# EAGLE design SNARFBASE-v03i4 (EAGLE 5.11)
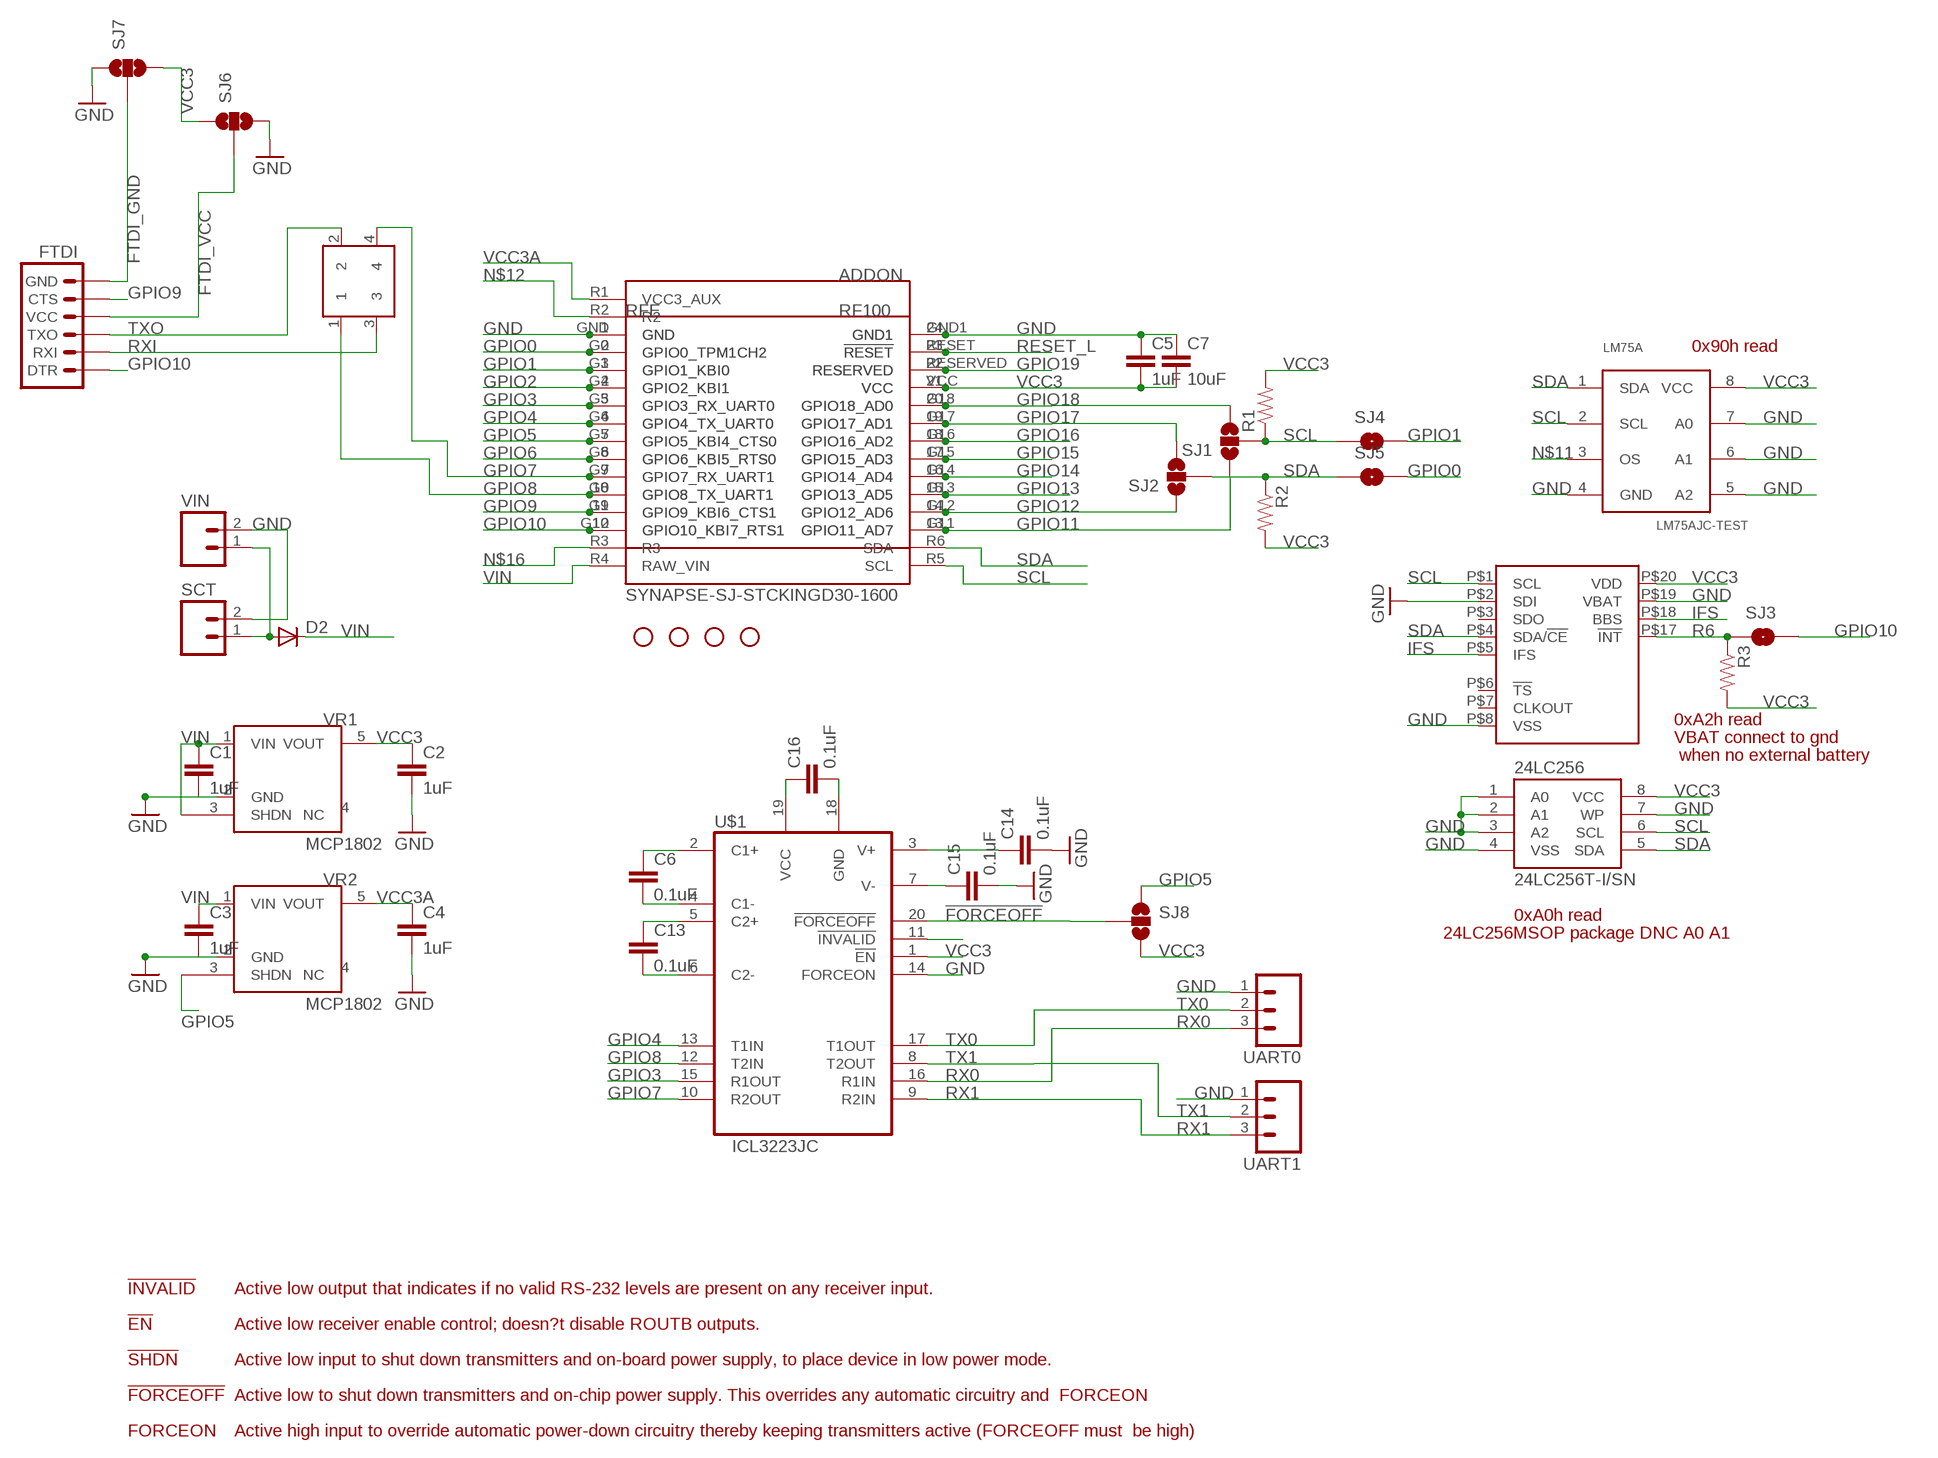
[diagram p0: schematic, sheet 1]

## Parts
24LC256  24LC256T-I/SN  EEPROM-I2CSMD  [SO08]
ADDON  SYNAPSE-SJ-STCKINGD30-1600  [SYNSJ-STACK]
C1  1uF  CAP0805  [0805]
C2  1uF  CAP0805  [0805]
C3  1uF  CAP0805  [0805]
C4  1uF  CAP0805  [0805]
C5  1uF  CAP0805  [0805]
C6  0.1uF  CAP0805  [0805]
C7  10uF  CAP0805  [0805]
C13  0.1uF  CAP0805  [0805]
C14  0.1uF  CAP0805  [0805]
C15  0.1uF  CAP0805  [0805]
C16  0.1uF  CAP0805  [0805]
D2  DIODESMA  [SMA-DIODE]
FTDI  ARDUINO_SERIAL_PROGRAMPTH  [1X06]
JP6  STAND-OFF  [STAND-OFF]
JP9  STAND-OFF  [STAND-OFF]
JP10  STAND-OFF  [STAND-OFF]
JP11  STAND-OFF  [STAND-OFF]
LM75A  LM75AJC-TEST  [TSSOP8-3MM]
PCF2129A  PCF2129ASO20  [SO20W]
R1  RESISTOR  [0805]
R2  RESISTOR  [0805]
R3  RESISTOR  [0805]
RFE  RFE  RF100-JACKJACK2  [SYNAPSERFENGINE-THM-SMT-JACK2]
RXTX  SERIAL_CROSSOVER  [2X02_PTH]
SCT  M023.5MM  [SCREWTERMINAL-3.5MM-2]
SJ1  SOLDERJUMPER_2WAYS  [SJ_3]
SJ2  SOLDERJUMPER_2WAYS  [SJ_3]
SJ3  SOLDERJUMPERNC2  [SJ_2S-NOTRACE]
SJ4  SOLDERJUMPERNO  [SJ_2S-NO]
SJ5  SOLDERJUMPERNO  [SJ_2S-NO]
SJ6  SOLDERJUMPER_2WAYPASTE1&2  [SJ_3_PASTE1&2]
SJ7  SOLDERJUMPER_2WAYPASTE1&2  [SJ_3_PASTE1&2]
SJ8  SOLDERJUMPER_2WAYPASTE1&2  [SJ_3_PASTE1&2]
U$1  ICL3223JC  [TSSOP20-JC]
UART0  M03PTH  [1X03]
UART1  M03PTH  [1X03]
VIN  M02PTH  [1X02]
VR1  MCP1802  [SOT23-5]
VR2  MCP1802  [SOT23-5]

## Nets
!FORCEOFF: SJ8.2 U$1.20(!FORCEOFF)
!INVALID: U$1.11(!INVALID)
FTDI_GND: FTDI.6(GND) SJ7.2
FTDI_VCC: FTDI.4(VCC) SJ6.2
GND: 24LC256.1(A0) 24LC256.2(A1) 24LC256.3(A2) 24LC256.4(VSS) 24LC256.7(WP) ADDON.GND ADDON.GND1 C1.2 C2.2 C3.2 C4.2 C5.1 C7.1 C14.2 C15.2 C16.2 LM75A.4(GND) LM75A.5(A2) LM75A.6(A1) LM75A.7(A0) PCF2129A.P$2(SDI) PCF2129A.P$8(VSS) PCF2129A.P$19(VBAT) RFE.1(GND) RFE.24(GND1) RFE.P1 RFE.P24 RFE.P201 RFE.P224 SCT.2 SJ6.3 SJ7.1 U$1.14(FORCEON) U$1.18(GND) UART0.1 UART1.1 VIN.2 VR1.2(GND) VR2.2(GND)
GPIO0: ADDON.G0(GPIO0_TPM1CH2) RFE.2(GPIO0_TPM1CH2) RFE.P2 RFE.P202 SJ5.2
GPIO1: ADDON.G1(GPIO1_KBI0) RFE.3(GPIO1_KBI0) RFE.P3 RFE.P203 SJ4.2
GPIO2: ADDON.G2(GPIO2_KBI1) RFE.4(GPIO2_KBI1) RFE.P4 RFE.P204
GPIO3: ADDON.G3(GPIO3_RX_UART0) RFE.5(GPIO3_RX_UART0) RFE.P5 RFE.P205 U$1.15(R1OUT)
GPIO4: ADDON.G4(GPIO4_TX_UART0) RFE.6(GPIO4_TX_UART0) RFE.P6 RFE.P206 U$1.13(T1IN)
GPIO5: ADDON.G5(GPIO5_KBI4_CTS0) RFE.7(GPIO5_KBI4_CTS0) RFE.P7 RFE.P207 SJ8.1 VR2.3(SHDN)
GPIO6: ADDON.G6(GPIO6_KBI5_RTS0) RFE.8(GPIO6_KBI5_RTS0) RFE.P8 RFE.P208
GPIO7: ADDON.G7(GPIO7_RX_UART1) RFE.9(GPIO7_RX_UART1) RFE.P9 RFE.P209 RXTX.4 U$1.10(R2OUT)
GPIO8: ADDON.G8(GPIO8_TX_UART1) RFE.10(GPIO8_TX_UART1) RFE.P10 RFE.P210 RXTX.1 U$1.12(T2IN)
GPIO9: ADDON.G9(GPIO9_KBI6_CTS1) FTDI.5(CTS) RFE.11(GPIO9_KBI6_CTS1) RFE.P11 RFE.P211
GPIO10: ADDON.G10(GPIO10_KBI7_RTS1) FTDI.1(DTR) RFE.12(GPIO10_KBI7_RTS1) RFE.P12 RFE.P212 SJ3.2
GPIO11: ADDON.G11(GPIO11_AD7) RFE.13(GPIO11_AD7) RFE.P13 RFE.P213 SJ1.1
GPIO12: ADDON.G12(GPIO12_AD6) RFE.14(GPIO12_AD6) RFE.P14 RFE.P214 SJ2.1
GPIO13: ADDON.G13(GPIO13_AD5) RFE.15(GPIO13_AD5) RFE.P15 RFE.P215
GPIO14: ADDON.G14(GPIO14_AD4) RFE.16(GPIO14_AD4) RFE.P16 RFE.P216
GPIO15: ADDON.G15(GPIO15_AD3) RFE.17(GPIO15_AD3) RFE.P17 RFE.P217
GPIO16: ADDON.G16(GPIO16_AD2) RFE.18(GPIO16_AD2) RFE.P18 RFE.P218
GPIO17: ADDON.G17(GPIO17_AD1) RFE.19(GPIO17_AD1) RFE.P19 RFE.P219 SJ2.3
GPIO18: ADDON.G18(GPIO18_AD0) RFE.20(GPIO18_AD0) RFE.P20 RFE.P220 SJ1.3
GPIO19: ADDON.RESERVED RFE.22(RESERVED) RFE.P22 RFE.P222
IFS: PCF2129A.P$5(IFS) PCF2129A.P$18(BBS)
N$1: C13.1 U$1.5(C2+)
N$2: C13.2 U$1.6(C2-)
N$3: C6.1 U$1.2(C1+)
N$5: C6.2 U$1.4(C1-)
N$9: C14.1 U$1.3(V+)
N$10: C15.1 U$1.7(V-)
N$11: LM75A.3(OS)
N$12: ADDON.R2
N$16: ADDON.R3
R6: PCF2129A.P$17(!INT) R3.1 SJ3.1
RESET_L: ADDON.RESET(!RESET) RFE.23(!RESET) RFE.P23 RFE.P223
RX0: UART0.3
RX1: U$1.9(R2IN) UART1.3
RXI: FTDI.2(RXI) RXTX.3
SCL: 24LC256.6(SCL) ADDON.R5(SCL) LM75A.2(SCL) PCF2129A.P$1(SCL) R1.1 SJ1.2 SJ4.1
SDA: 24LC256.5(SDA) ADDON.R6(SDA) LM75A.1(SDA) PCF2129A.P$4(SDA/!CE) R2.1 SJ2.2 SJ5.1
TX0: U$1.17(T1OUT) UART0.2
TX1: UART1.2
TXO: FTDI.3(TXO) RXTX.2
VCC3: 24LC256.8(VCC) ADDON.VCC C2.1 C5.2 C7.2 C16.1 LM75A.8(VCC) PCF2129A.P$20(VDD) R1.2 R2.2 R3.2 RFE.21(VCC) RFE.P21 RFE.P221 SJ6.1 SJ7.3 SJ8.3 U$1.1(!EN) U$1.19(VCC) VR1.5(VOUT)
VCC3A: ADDON.R1(VCC3_AUX) C4.1 VR2.5(VOUT)
VIN: ADDON.R4(RAW_VIN) C1.1 C3.1 D2.C VR1.1(VIN) VR1.3(SHDN) VR2.1(VIN)
VIN_PREDIODE: D2.A SCT.1 VIN.1
Unconnected: PCF2129A.P$3(SDO) PCF2129A.P$6(!TS) PCF2129A.P$7(CLKOUT) U$1.8(T2OUT) U$1.16(R1IN) VR1.4(NC) VR2.4(NC)

## Notes on the sheet
- 0x90h read
- 0xA2h read
- VBAT connect to gnd
- when no external battery
- 0xA0h read
- 24LC256MSOP package DNC A0 A1
- !INVALID | Active low output that indicates if no valid RS-232 levels are present on any receiver input.
- !EN | Active low receiver enable control; doesn?t disable ROUTB outputs.
- !SHDN | Active low input to shut down transmitters and on-board power supply, to place device in low power mode.
- !FORCEOFF | Active low to shut down transmitters and on-chip power supply. This overrides any automatic circuitry and  FORCEON
- FORCEON | Active high input to override automatic power-down circuitry thereby keeping transmitters active (FORCEOFF must  be high)

## Library data of the parts
24LC256 = SparkFun:EEPROM-I2C
ADDON = 0_jc-custom:SYNAPSE-SJ-STCKING: Standard layout for expansion modules using Synapse Wireless boards
C1-C7 C13-C16 = 0_jc-custom:CAP: Capacitor Standard 0603 ceramic capacitor, and 0.1" leaded capacitor.
D2 = SparkFun:DIODE: Diode These are standard reverse protection diodes and small signal diodes. SMA package can handle up to about 1A. SOD-323 can handle about 200mA. What the SOD-323 package when ordering, there are some mfgs out there that are 5-pin packages.
FTDI = SparkFun:ARDUINO_SERIAL_PROGRAM
JP6 JP9-JP11 = SparkFun:STAND-OFF: Stand Off This is the mechanical footprint for a #4 phillips button head screw. Use the keepout ring to avoid running the screw head into surrounding components. SKU : PRT-00447
LM75A = 0_jc-custom:LM75A
PCF2129A = 0_jc-custom:PCF2129A
R1-R3 = SparkFun:RESISTOR: Resistor Basic schematic elements and footprints for 0603, 1206, and PTH 1/10th watt (small) resistors.
RFE = 0_jc-custom:RF100-JACK
RXTX = 0_jc-custom:SERIAL_CROSSOVER
SCT VIN = SparkFun:M02: Header 2 Standard 2-pin 0.1" header. Use with straight break away headers (SKU : PRT-00116), right angle break away headers (PRT-00553), swiss pins (PRT-00743), machine pins (PRT-00117), and female headers (PRT-00115). Molex polarized connector foot print use with SKU : PRT-08233 with associated crimp pins and housings.
SJ1 SJ2 SJ6-SJ8 = SparkFun:SOLDERJUMPER_2WAY: Solder Jumper 2 way solder jumper
SJ3-SJ5 = SparkFun:SOLDERJUMPER: Solder Jumper Standard SMD solder jumper. Used to automate production. Two varients : Normally Open and Normally Closed are the same, but have different paste layers. NC will have a large amount of paste and should jumper during reflow.
U$1 = 0_jc-custom:ICL3223
UART0 UART1 = SparkFun:M03: Header 3 Standard 3-pin 0.1" header. Use with straight break away headers (SKU : PRT-00116), right angle break away headers (PRT-00553), swiss pins (PRT-00743), machine pins (PRT-00117), and female headers (PRT-00115). Molex polarized connector foot print use with SKU : PRT-08232 with associated crimp pins and housings.
VR1 VR2 = 0_jc-custom:MCP1802

## Net classes
0 default: width 0.254 mm
1 Power: width 0.508 mm
2 smallsignal: width 0.152 mm
3 stdsignal: width 0.254 mm

## Board
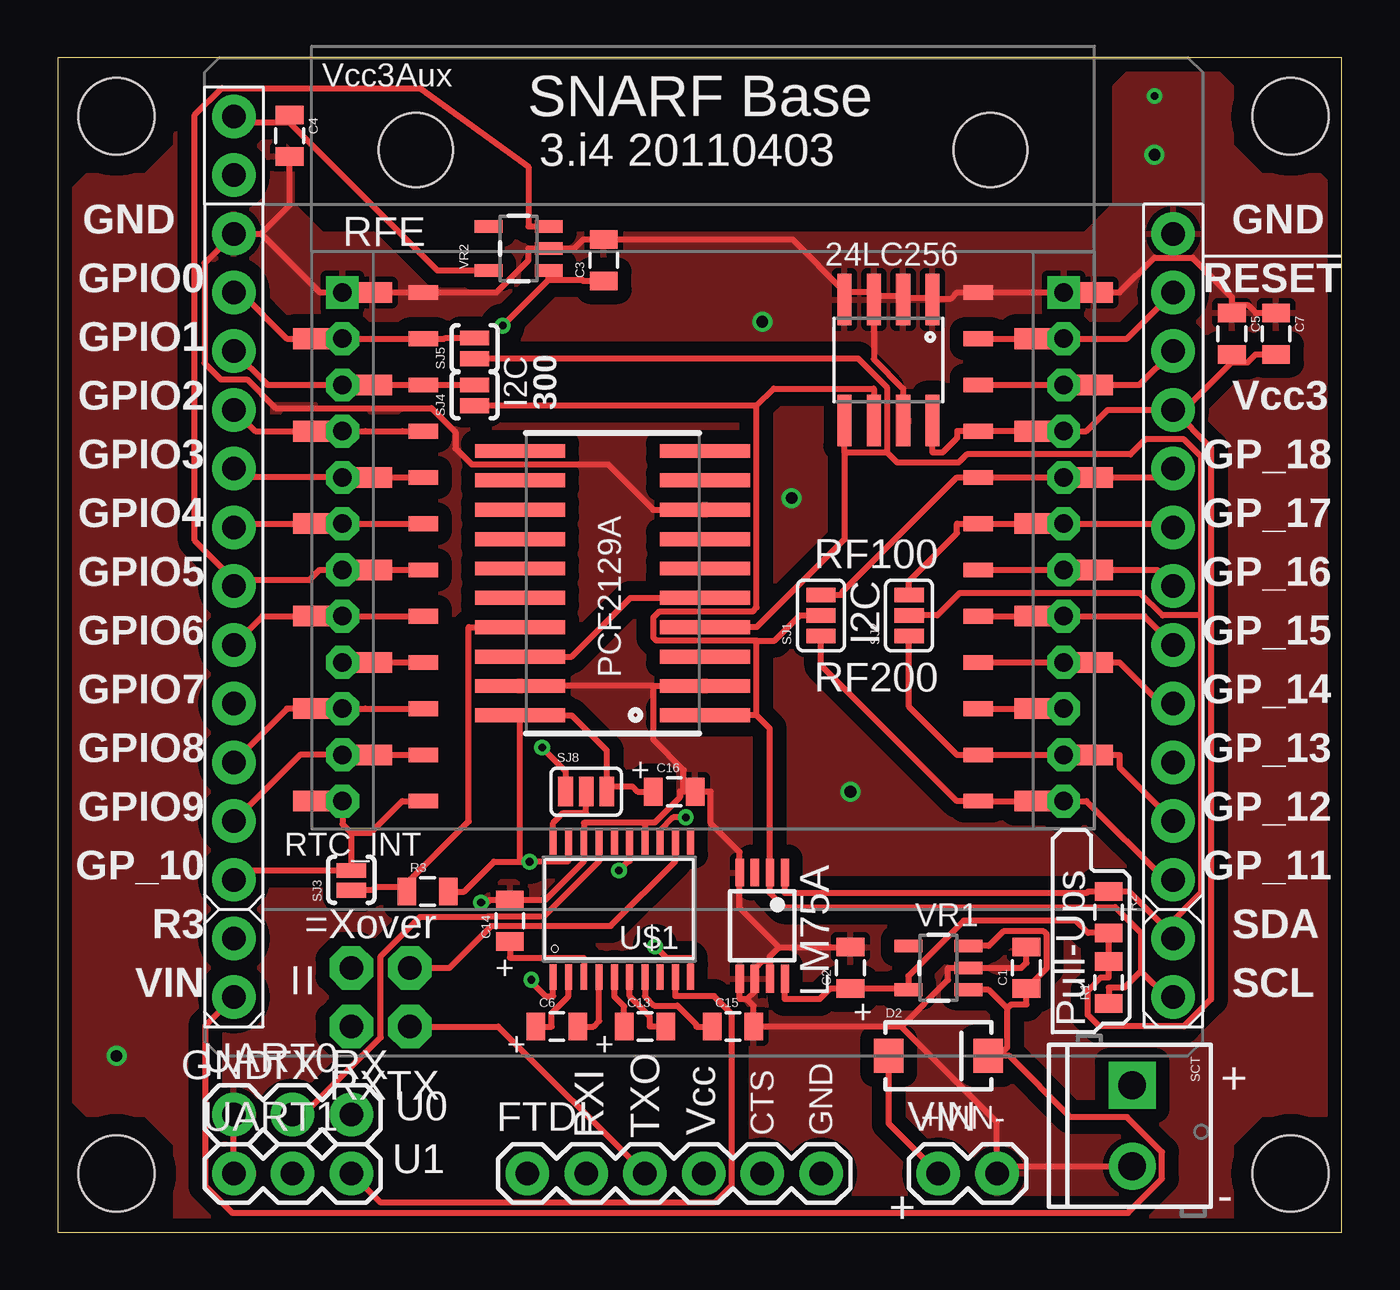
[diagram p1: board, top side]
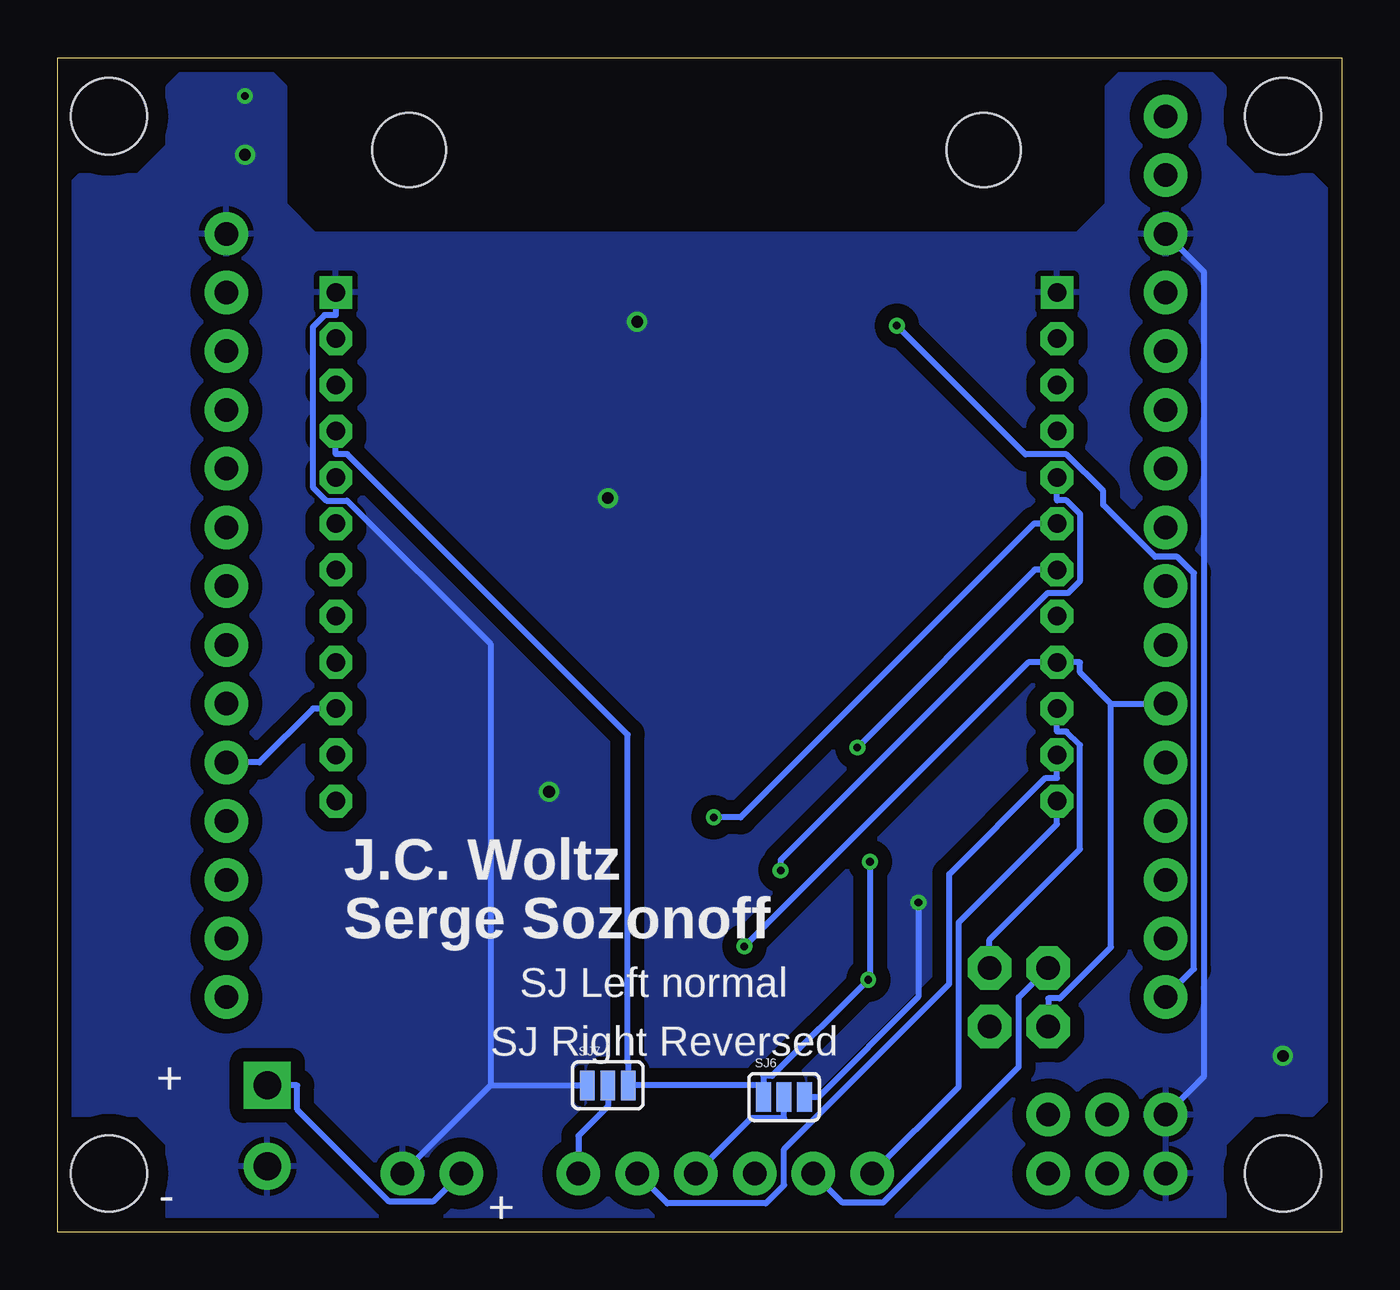
[diagram p2: board, bottom side, seen from below]

Size 55.55 x 50.79 mm. Coordinates in mm from the lower left corner, seen from the top.
Outline: 0,0 55.55,0 55.55,50.79 0,50.79 0,0
Copper layers (1*16): Top 0.0356mm / dielectric 1.5011mm / Bottom 0.0356mm
Design rules "LaenPCBOrder-JCModified": minimum track width 6mil, minimum drill 13mil, track to track 6mil, track to pad 6mil, pad to pad 6mil, via to via 6mil, smd to smd 6mil, copper to edge 15mil, drill to drill 6mil, minimum pad ring 12mil, minimum via ring 7mil, stop-mask expansion 4mil, vias tented up to drill 25mil, thermal gap 10mil

### Footprints (pad centres in the part's own frame; a part is rotated, then mirrored left to right if it is on the bottom)
SO08 = smd 0.61 x 2.21: 1 -1.905,-2.616; 2 -0.635,-2.616; 3 0.635,-2.616; 4 1.905,-2.616; 5 1.905,2.616; 6 0.635,2.616; 7 -0.635,2.616; 8 -1.905,2.616
SYNSJ-STACK = drill 1.016 pad 1.88 round: G0 0,-7.62; G1 0,-10.16; G2 0,-12.7; G3 0,-15.24; G4 0,-17.78; G5 0,-20.32; G6 0,-22.86; G7 0,-25.4; G8 0,-27.94; G9 0,-30.48; G10 0,-33.02; G11 40.64,-33.02; G12 40.64,-30.48; G13 40.64,-27.94; G14 40.64,-25.4; G15 40.64,-22.86; G16 40.64,-20.32; G17 40.64,-17.78; G18 40.64,-15.24; GND 0,-5.08; GND1 40.64,-5.08; R1 0,0; R2 0,-2.54; R3 0,-35.56; R4 0,-38.1; R5 40.64,-38.1; R6 40.64,-35.56; RESERVED 40.64,-10.16; RESET 40.64,-7.62; VCC 40.64,-12.7
0805 = smd 0.8 x 1.2: 1 -0.9,0; 2 0.9,0
SMA-DIODE = smd 1.27 x 1.47: A -2.15,0; C 2.15,0
1X06 = drill 1.016 pad 1.88 round: 1 0,0; 2 2.54,0; 3 5.08,0; 4 7.62,0; 5 10.16,0; 6 12.7,0
STAND-OFF = hole 3.302: 0,0
TSSOP8-3MM = smd 1.2 x 0.35: 1 -2.6,0.975; 2 -2.6,0.325; 3 -2.6,-0.325; 4 -2.6,-0.975; 5 2,-0.975; 6 2,-0.325; 7 2,0.325; 8 2,0.975
SO20W = smd 0.6 x 3.9: P$1 -5.715,-4; P$2 -4.445,-4; P$3 -3.175,-4; P$4 -1.905,-4; P$5 -0.635,-4; P$6 0.635,-4; P$7 1.905,-4; P$8 3.175,-4; P$9 4.445,-4; P$10 5.715,-4; P$11 5.715,4; P$12 4.445,4; P$13 3.175,4; P$14 1.905,4; P$15 0.635,4; P$16 -0.635,4; P$17 -1.905,4; P$18 -3.175,4; P$19 -4.445,4; P$20 -5.715,4
SYNAPSERFENGINE-THM-SMT-JACK2 = drill 0.8 square: 1 0,0; 24 31.2,0 | drill 0.8 pad 1.422 octagon: 2 0,-2; 3 0,-4; 4 0,-6; 5 0,-8; 6 0,-10; 7 0,-12; 8 0,-14; 9 0,-16; 10 0,-18; 11 0,-20; 12 0,-22; 13 31.2,-22; 14 31.2,-20; 15 31.2,-18; 16 31.2,-16; 17 31.2,-14; 18 31.2,-12; 19 31.2,-10; 20 31.2,-8; 21 31.2,-6; 22 31.2,-4; 23 31.2,-2 | smd 1.67 x 0.89: P1 1.3,0; P2 -1.3,-2; P3 1.3,-4; P4 -1.3,-6; P5 1.3,-8; P6 -1.3,-10; P7 1.3,-12; P8 -1.3,-14; P9 1.3,-16; P10 -1.3,-18; P11 1.3,-20; P12 -1.3,-22; P13 29.9,-22; P14 32.5,-20; P15 29.9,-18; P16 32.5,-16; P17 29.9,-14; P18 32.5,-12; P19 29.9,-10; P20 32.5,-8; P21 29.9,-6; P22 32.5,-4; P23 29.9,-2; P24 32.5,0 | smd 1.27 x 0.635: P201 3.5,0; P202 3.5,-2; P203 3.5,-4; P204 3.5,-6; P205 3.5,-8; P206 3.5,-10; P207 3.5,-12; P208 3.5,-14; P209 3.5,-16; P210 3.5,-18; P211 3.5,-20; P212 3.5,-22; P213 27.5,-22; P214 27.5,-20; P215 27.5,-18; P216 27.5,-16; P217 27.5,-14; P218 27.5,-12; P219 27.5,-10; P220 27.5,-8; P221 27.5,-6; P222 27.5,-4; P223 27.5,-2; P224 27.5,0 | hole 3.2: 3.17,6.16; 28.03,6.16
2X02_PTH = drill 1.016 pad 1.88 octagon: 1 -1.27,-1.27; 2 -1.27,1.27; 3 1.27,-1.27; 4 1.27,1.27
SCREWTERMINAL-3.5MM-2 = drill 1.2 pad 2.032 square: 1 0,0 | drill 1.2 pad 2.032 round: 2 3.5,0
SJ_3 = smd 0.635 x 1.27: 1 -0.889,0; 2 0,0; 3 0.889,0
SJ_2S-NOTRACE = smd 0.635 x 1.27: 1 -0.45,0; 2 0.4,0
SJ_2S-NO = smd 0.635 x 1.27: 1 -0.45,0; 2 0.45,0
SJ_3_PASTE1&2 = smd 0.635 x 1.27: 1 -0.889,0; 2 0,0; 3 0.889,0
TSSOP20-JC = smd 1.1 x 0.3: 1 -2.937,2.693; 2 -2.937,2.032; 3 -2.937,1.372; 4 -2.937,0.712; 5 -2.937,0.051; 6 -2.937,-0.609; 7 -2.937,-1.27; 8 -2.943,-1.93; 9 -2.937,-2.59; 10 -2.937,-3.251; 11 2.905,-3.251; 12 2.905,-2.59; 13 2.911,-1.93; 14 2.905,-1.27; 15 2.905,-0.609; 16 2.905,0.051; 17 2.905,0.712; 18 2.905,1.372; 19 2.905,2.032; 20 2.905,2.693
1X03 = drill 1.016 pad 1.88 round: 1 0,0; 2 2.54,0; 3 5.08,0
1X02 = drill 1.016 pad 1.88 round: 1 0,0; 2 2.54,0
SOT23-5 = smd 0.55 x 1.2: 1 -0.95,-1.3; 2 0,-1.3; 3 0.95,-1.3; 4 0.95,1.3; 5 -0.95,1.3

### Placement (x,y rotation side)
24LC256  35.94,37.72 180 top
ADDON  7.62,48.26 0 top
C1  41.91,11.43 90 top
C2  34.29,11.43 90 top
C3  23.62,42.04 90 top
C4  10.03,47.42 270 top
C5  50.8,38.86 270 top
C6  21.59,8.89 0 top
C7  52.7,38.86 270 top
C13  25.4,8.89 0 top
C14  19.56,13.46 90 top
C15  29.21,8.89 0 top
C16  26.67,19.05 0 top
D2  38.1,7.62 0 top
FTDI  20.32,2.54 0 top
JP6  53.34,2.54 0 top
JP9  2.54,2.54 0 top
JP10  53.34,48.26 0 top
JP11  2.54,48.26 0 top
LM75A  30.48,12.95 270 top
PCF2129A  24,28.07 90 top
R1  45.47,10.79 90 top
R2  45.47,13.84 270 top
R3  16,14.73 0 top
RFE  12.32,40.64 0 top
RXTX  13.97,10.16 180 top
SCT  46.48,6.35 270 top
SJ1  33.02,26.67 90 top
SJ2  36.83,26.67 90 top
SJ3  12.7,15.24 90 top
SJ4  18.03,36.2 90 top
SJ5  18.03,38.23 90 top
SJ6  24.13,5.84 0 bottom
SJ7  31.75,6.35 0 bottom
SJ8  22.86,19.05 0 top
U$1  24.13,13.97 90 top
UART0  7.62,5.08 0 top
UART1  7.62,2.54 0 top
VIN  38.1,2.54 0 top
VR1  38.1,11.43 90 top
VR2  19.94,42.55 90 top

### Tracks (layer width: path | path; a pad name or v marks a point on that pad's centre or on a via)
!FORCEOFF
  Top 0.254: SJ8.2 22.86,18.14 21.87,18.14 21.44,17.7 U$1.20
FTDI_GND
  Bottom 0.254: SJ7.2 31.75,5.44 33.02,4.17 FTDI.6
FTDI_VCC
  Bottom 0.254: SJ6.2 24.13,4.93 25.55,4.93 FTDI.4
GND  (via drill 0.33 pad 0.69, 0.51, 0.51 pad 0.69)
  Top 0.254: 25.4,17.7 25.4,17.6 U$1.14 | 25.4,17.7 25.41,17.71 25.83,17.71 26.92,18.8 26.92,19.05 27.08,19.05 | 25.4,17.7 22.76,17.7 U$1.18 22.76,16.05 21.07,14.36 C14.2 18.68,14.36 18.57,14.25 v18.32,14.25 | 31.21,12.33 33.41,12.33 C2.2 | 31.21,12.33 29.5,14.03 LM75A.4 29.5,16.43 28.25,17.69 28.25,19.05 C16.2 27.25,19.05 27.08,19.05 | 30.8,11.73 30.8,11.93 31.21,12.33 | 36.5,8.89 38.52,10.91 38.52,11.43 VR1.2 41.69,11.43 41.91,11.65 C1.2 | 36.5,8.89 30.79,8.89 C15.2 30.11,9.79 29.82,10.07 | 36.5,8.89 40.64,4.75 40.64,2.85 | 25.77,23.62 PCF2129A.P$19 | 25.77,23.62 PCF2129A.P$2 | 27.08,19.05 27.08,19.99 25.77,21.3 25.77,23.62 | 30.8,11.73 30.49,11.73 30.16,11.39 LM75A.6 30.16,10.51 30.16,10.4 29.82,10.07 | PCF2129A.P$8 26.99,31.24 25.77,31.24 23.81,33.2 17.91,33.2 17.21,33.9 17.21,34.6 16.17,35.64 9.43,35.64 8.19,36.88 7.06,36.88 6.35,37.59 6.35,41.91 ADDON.GND 8.79,43.18 | 30.8,11.73 LM75A.7 | 29.82,10.07 29.5,10.07 LM75A.5 | 37.85,40.38 38.64,40.38 38.9,40.64 RFE.P224 RFE.24 RFE.P24 45.93,40.64 47.44,42.15 48.26,42.15 | 37.85,40.38 37.85,40.42 36.58,40.42 | 37.85,40.38 24LC256.1 | VIN.2 40.64,2.85 | 40.64,2.85 SCT.2 | 36.58,40.42 36.58,40.51 35.31,40.51 | 36.58,40.42 24LC256.2 | 34.04,40.68 31.78,42.94 C3.2 22.74,42.94 22.35,42.55 VR2.2 20.36,42.55 20.36,42.02 18.98,40.64 RFE.P201 RFE.P1 RFE.1 11.34,40.64 8.79,43.18 | UART1.1 UART0.1 | C7.1 51.83,39.76 51.49,40.1 50.8,40.1 | 50.8,40.1 50.8,40.44 49.09,42.15 48.26,42.15 | 50.8,40.1 C5.1 | 35.31,40.51 35.31,40.68 34.04,40.68 | 35.31,40.51 24LC256.3 35.31,38.95 35.31,37.76 36.58,36.49 24LC256.7 | 34.04,40.68 24LC256.4 | C4.2 10.03,44.42 8.79,43.18
  Top 0.254: 48.26,42.15 ADDON.GND1
  Bottom 0.254: UART0.1 5.95,6.75 5.95,41.51 ADDON.GND | SJ6.3 22.64,5.84 18.32,10.17 v18.32,14.25 | RFE.24 43.52,39.66 44.01,39.66 44.52,39.15 44.52,32.22 43.94,31.64 43.03,31.64 36.83,25.44 36.83,6.35 | 36.83,6.35 VIN.2 | 36.83,6.35 SJ7.1
  other vias: 47.45,49.14 47.45,46.6 34.29,19.05 2.54,7.62 30.48,39.37 31.75,31.75
  pour Top (isolate 0.61): 0,44.45 0,6.35 1.27,5.08 3.81,5.08 5.08,3.81 5.08,0 50.8,0 50.8,3.81 52.07,5.08 55.88,5.08 55.88,44.45 54.61,45.72 52.07,45.72 50.8,46.99 50.8,49.53 49.53,50.8 46.99,50.8 45.72,49.53 45.72,44.45 44.45,43.18 11.43,43.18 10.16,44.45 10.16,49.53 8.89,50.8 6.35,50.8 5.08,49.53 5.08,46.99 3.81,45.72 1.27,45.72
  pour Bottom (isolate 0.61): 0,44.45 0,6.35 1.27,5.08 3.81,5.08 5.08,3.81 5.08,0 50.8,0 50.8,3.81 52.07,5.08 55.88,5.08 55.88,44.45 54.61,45.72 52.07,45.72 50.8,46.99 50.8,49.53 49.53,50.8 46.99,50.8 45.72,49.53 45.72,44.45 44.45,43.18 11.43,43.18 10.16,44.45 10.16,49.53 8.89,50.8 6.35,50.8 5.08,49.53 5.08,46.99 3.81,45.72 1.27,45.72
GPIO0
  Top 0.254: SJ5.2 16.77,38.68 16.73,38.64 RFE.P202 RFE.2 RFE.P2 9.9,38.64 7.9,40.64 ADDON.G0
GPIO1
  Top 0.254: SJ4.2 16.74,36.65 16.73,36.64 RFE.P203 RFE.P3 RFE.3 9.08,36.64 ADDON.G1
GPIO2
  Top 0.254: RFE.P204 14.9,34.64 13.31,34.64 RFE.4 RFE.P4 8.54,34.64 ADDON.G2
GPIO3  (via drill 0.33 pad 0.69)
  Top 0.254: U$1.15 24.74,16.05 24.68,16.05 v24.28,15.64 | RFE.P205 RFE.P5 RFE.5 8,32.64 ADDON.G3
  Bottom 0.254: RFE.5 12.32,31.65 11.91,31.65 11.31,31.05 11.31,28.18 11.85,27.64 12.72,27.64 24.28,16.09 v24.28,15.64
GPIO4  (via drill 0.33 pad 0.69)
  Top 0.254: U$1.13 26.06,17.37 26.63,17.94 v27.17,17.94 | RFE.P206 RFE.6 RFE.P6 7.78,30.64 ADDON.G4
  Bottom 0.254: RFE.6 13.31,30.64 26.01,17.94 v27.17,17.94
GPIO5  (via drill 0.33 pad 0.69)
  Top 0.254: 7.62,28.22 10.9,28.22 11.33,28.64 RFE.7 RFE.P7 RFE.P207 | 7.62,28.22 5.93,29.9 5.93,48.32 7.1,49.48 15.68,49.48 20.36,46.08 20.36,43.49 VR2.3 | 7.62,28.22 ADDON.G5 | SJ8.1 21.97,19.96 21.95,19.96 v20.96,20.96
  Bottom 0.254: RFE.7 13.31,28.64 13.31,28.61 v20.96,20.96
GPIO6
  Top 0.254: RFE.P208 RFE.8 RFE.P8 8.86,26.64 ADDON.G6
GPIO7  (via drill 0.33 pad 0.69)
  Top 0.254: U$1.10 27.38,11.86 26.34,11.86 v25.84,12.36 | RFE.P209 RFE.P9 RFE.9
  Bottom 0.254: 9.98,22.86 9.98,12.32 12.2,10.11 12.7,10.11 RXTX.4 | 9.98,22.86 ADDON.G7 | 9.98,22.86 11.33,24.21 11.33,24.64 RFE.9 13.56,24.64 v25.84,12.36
GPIO8
  Top 0.254: ADDON.G8 9.9,22.61 9.9,22.64 RFE.P10 RFE.10 13.31,22.64 RFE.P210 | RXTX.1 16.46,11.43 16.95,11.43 18.76,13.24 23.92,13.24 26.72,16.05 U$1.12
  Bottom 0.254: RFE.10 12.32,21.65 11.91,21.65 11.33,21.07 11.33,16.56 15.24,12.65 RXTX.1
GPIO9
  Top 0.254: ADDON.G9 10.48,20.64 RFE.11 RFE.P11 RFE.P211
  Bottom 0.254: RFE.11 12.32,19.65 12.81,19.65 16.98,15.49 16.98,10.74 24.13,3.59 24.13,2.03 24.92,1.24 29.18,1.24 FTDI.5
GPIO10
  Top 0.254: ADDON.G10 8.02,15.64 SJ3.2 12.7,17.27 | 12.7,17.27 12.32,17.65 12.32,18.14 | 12.7,17.27 13.53,17.27 14.9,18.64 RFE.P212 | RFE.P12 12.13,18.64 12.13,18.33 12.32,18.14 | RFE.12 12.32,18.14
  Bottom 0.254: RFE.12 12.32,17.65 16.57,13.4 16.57,6.29 FTDI.1
GPIO11
  Top 0.254: ADDON.G11 47.91,15.24 44.51,18.64 RFE.13 RFE.P13 RFE.P213 38.9,18.64 33.02,24.52 33.02,25.18 SJ1.1
GPIO12
  Top 0.254: ADDON.G12 45.93,20.11 45.93,20.64 RFE.P14 RFE.14 RFE.P214 38.9,20.64 36.83,22.71 SJ2.1
GPIO13
  Top 0.254: RFE.15 RFE.P15 RFE.P215
  Bottom 0.254: RFE.15 44.51,22.64 46.83,20.32 ADDON.G13
GPIO14
  Top 0.254: ADDON.G14 47.71,22.86 45.93,24.64 RFE.P16 RFE.16 RFE.P216
GPIO15
  Top 0.254: ADDON.G15 47.02,26.64 RFE.17 RFE.P17 RFE.P217
GPIO16
  Top 0.254: ADDON.G16 47.56,28.64 RFE.P18 RFE.18 RFE.P218
GPIO17
  Top 0.254: SJ2.3 36.83,28.16 38.9,30.23 38.9,30.64 RFE.P219 RFE.P19 RFE.19 48.1,30.64 ADDON.G17
GPIO18
  Top 0.254: SJ1.3 33.93,27.56 33.93,27.67 38.9,32.64 RFE.P220 RFE.20 RFE.P20 47.88,32.64 ADDON.G18
GPIO19
  Top 0.254: ADDON.RESERVED 46.8,36.64 RFE.P22 RFE.22 RFE.P222
IFS
  Top 0.254: PCF2129A.P$18 22.23,24.89 24.77,27.43 PCF2129A.P$5
N$1
  Top 0.254: C13.1 24.5,9.77 24.08,10.19 U$1.5
N$2
  Top 0.254: C13.2 25.62,8.89 25.62,9.32 24.74,10.2 U$1.6
N$3
  Top 0.254: C6.1 21.37,8.89 21.37,9.47 22.1,10.2 U$1.2
N$5
  Top 0.254: C6.2 23.17,8.89 23.42,9.14 U$1.4
N$9
  Top 0.254: C14.1 19.56,11.88 19.58,11.86 22.76,11.86 U$1.3
N$10
  Top 0.254: C15.1 27.63,8.89 27.63,8.97 26.81,9.8 25.81,9.8 25.4,10.2 U$1.7
R6
  Top 0.254: PCF2129A.P$17 17.77,26.16 17.77,17.76 14.92,14.91 | 14.92,14.91 13.73,14.91 13.61,14.79 SJ3.1 | R3.1 14.92,14.91
RESET_L
  Top 0.254: ADDON.RESET 46.26,38.64 RFE.23 RFE.P23 RFE.P223
RX1
  Top 0.254: U$1.9 26.72,10.2 28.39,10.2 29.16,9.43 29.16,2.03 28.43,1.29 13.95,1.29 UART1.3
RXI
  Bottom 0.254: RXTX.3 13.97,10.16 13.97,7.15 19.84,1.28 21.6,1.28 FTDI.2
SCL
  Top 0.254: 30.23,25.58 31.02,25.58 32.1,26.67 SJ1.2 | 30.23,35.74 30.23,27.02 30.07,26.85 26.04,26.85 25.77,26.59 25.77,25.71 25.9,25.58 30.23,25.58 | 30.23,22.35 30.23,25.58 | 30.23,35.74 30.98,36.49 35.31,36.49 24LC256.6 | 30.23,35.74 SJ4.1 | 30.23,22.35 30.8,21.78 LM75A.2 30.8,15.11 30.8,14.68 31.42,14.06 45.75,14.06 46.86,12.95 46.86,11.29 | 30.23,22.35 PCF2129A.P$1 | R1.1 45.47,10.57 46.15,10.57 46.86,11.29 | ADDON.R5 47.99,10.16 46.86,11.29
SDA
  Top 0.254: 34.04,33.72 34.04,29.96 30.23,26.16 PCF2129A.P$4 | 35.89,33.72 34.04,33.72 | 35.89,33.72 35.89,36.52 34.63,37.78 SJ5.1 | 49.49,26.67 49.49,33.53 48.73,34.28 47.05,34.28 46.41,33.64 39.33,33.64 38.97,33.28 36.32,33.28 35.89,33.72 | 34.04,33.72 24LC256.5 | 49.49,26.67 47.81,26.67 46.84,27.64 39.02,27.64 38.05,26.67 SJ2.2 | 47.94,13.15 49.49,14.69 49.49,26.67 | 47.94,13.15 48.26,12.83 ADDON.R6 | 47.94,13.15 46.35,14.74 R2.1 44.59,14.74 44.52,14.68 31.45,14.68 31.45,15.33 LM75A.1
TX0
  Top 0.254: UART0.2 10.62,5.08 13.97,8.43 13.97,11.94 15.67,13.63 18.57,13.63 18.6,13.66 21.03,13.66 23.42,16.05 U$1.17
TXO
  Top 0.254: FTDI.3 19.05,8.89 RXTX.2
VCC3  (via drill 0.33 pad 0.69)
  Top 0.254: 20,16.02 18.87,16.02 17.58,14.73 R3.2 | 20,16.02 v20.41,16.02 20.44,16.05 22.1,16.05 U$1.19 | 20,16.02 PCF2129A.P$20 22.23,22.35 23.75,20.84 23.75,19.28 | 23.75,19.28 24.86,19.28 25.09,19.05 C16.1 | 36.8,10.53 36.8,11.08 39.2,13.48 44.05,13.48 44.59,12.94 R2.2 R1.2 45.47,11.02 45.13,11.02 44.56,10.45 44.56,9.39 45.05,8.9 48.73,8.9 49.89,10.06 49.89,33.93 ADDON.VCC | 36.8,10.53 VR1.5 | 36.8,10.53 35.17,10.53 C2.1 33.41,10.53 32.95,10.07 31.45,10.07 LM75A.8 | U$1.1 21.44,10.2 21.11,10.2 20.49,10.83 v20.49,10.92 | 50.8,37.62 48.74,35.56 ADDON.VCC | 50.8,37.62 51.49,37.62 51.83,37.96 C7.2 | 23.75,19.28 SJ8.3 | 50.8,37.62 C5.2 | ADDON.VCC 45.43,35.56 44.51,34.64 RFE.21 RFE.P21 RFE.P221 38.9,34.64 38.9,34.34 38.28,33.72 37.85,33.72 24LC256.8
  Bottom 0.254: 30.26,6.35 SJ7.3 30.86,7.26 30.89,7.3 30.89,21.52 43.02,33.65 43.52,33.65 RFE.21 | 25.02,6.35 25.02,6.76 24.65,6.76 v20.49,10.92 20.41,10.99 v20.41,16.02 | 25.02,6.35 SJ6.1 | 30.26,6.35 | 25.02,6.35 30.26,6.35
VCC3A
  Top 0.254: VR2.5 16.42,41.59 10.03,47.98 | 10.03,47.98 7.9,47.98 ADDON.R1 | 10.03,47.98 C4.1
VIN  (via drill 0.33 pad 0.69)
  Top 0.254: 41.08,9.68 40.28,10.48 VR1.1 | 41.08,9.68 41.26,9.85 41.91,9.85 C1.1 42.79,11.41 42.79,12.88 42.66,13.01 40.91,13.01 40.28,12.38 VR1.3 | 40.71,7.62 41.08,8 41.08,9.68 | 40.71,7.62 41.16,7.62 43.81,4.97 46.26,4.97 47.78,3.46 47.78,2.31 46.3,0.84 7.55,0.84 6.4,1.99 6.4,8.94 ADDON.R4 | 40.71,7.62 D2.C | 21.24,41.2 VR2.1 | v19.25,39.21 21.24,41.2 | 21.24,41.2 22.68,41.2 22.74,41.14 C3.1
  Bottom 0.254: ADDON.R4 6.4,11.38 6.4,28.5 7.11,29.21 8.07,29.21 10.32,31.46 10.32,32.06 11.91,33.64 13.68,33.64 v19.25,39.21
VIN_PREDIODE
  Top 0.254: VIN.1 35.95,4.69 D2.A
  Bottom 0.254: SCT.1 45.19,6.35 45.19,5.3 41.21,1.32 39.32,1.32 VIN.1

### Text on the board
tPlace: Vcc3Aux | SNARF Base | 3.i4 20110403 | GND | GND | GPIO0 | !RESET | GPIO1 | GPIO2 | I2C | 300 | Vcc3 | GPIO3 | GP_18 | GPIO4 | RF100 | GP_17 | GPIO5 | GP_16 | GPIO6 | I2C | RF200 | GP_15 | GPIO7 | GP_14 | GPIO8 | GP_13 | GPIO9 | + | GP_12 | GP_10 | RTC_INT | GP_11 | R3 | =Xover | SDA | VIN | + | = | SCL | + | Pull-Ups | + | + | GND | TX | RX | + | U0 | RXI | TXO | Vcc | CTS | GND | +VIN- | U1 | - | +
bPlace: J.C. Woltz | Serge Sozonoff | SJ Left normal | SJ Right Reversed | + | - | +